# EAGLE design untitled (EAGLE 8.4.3)
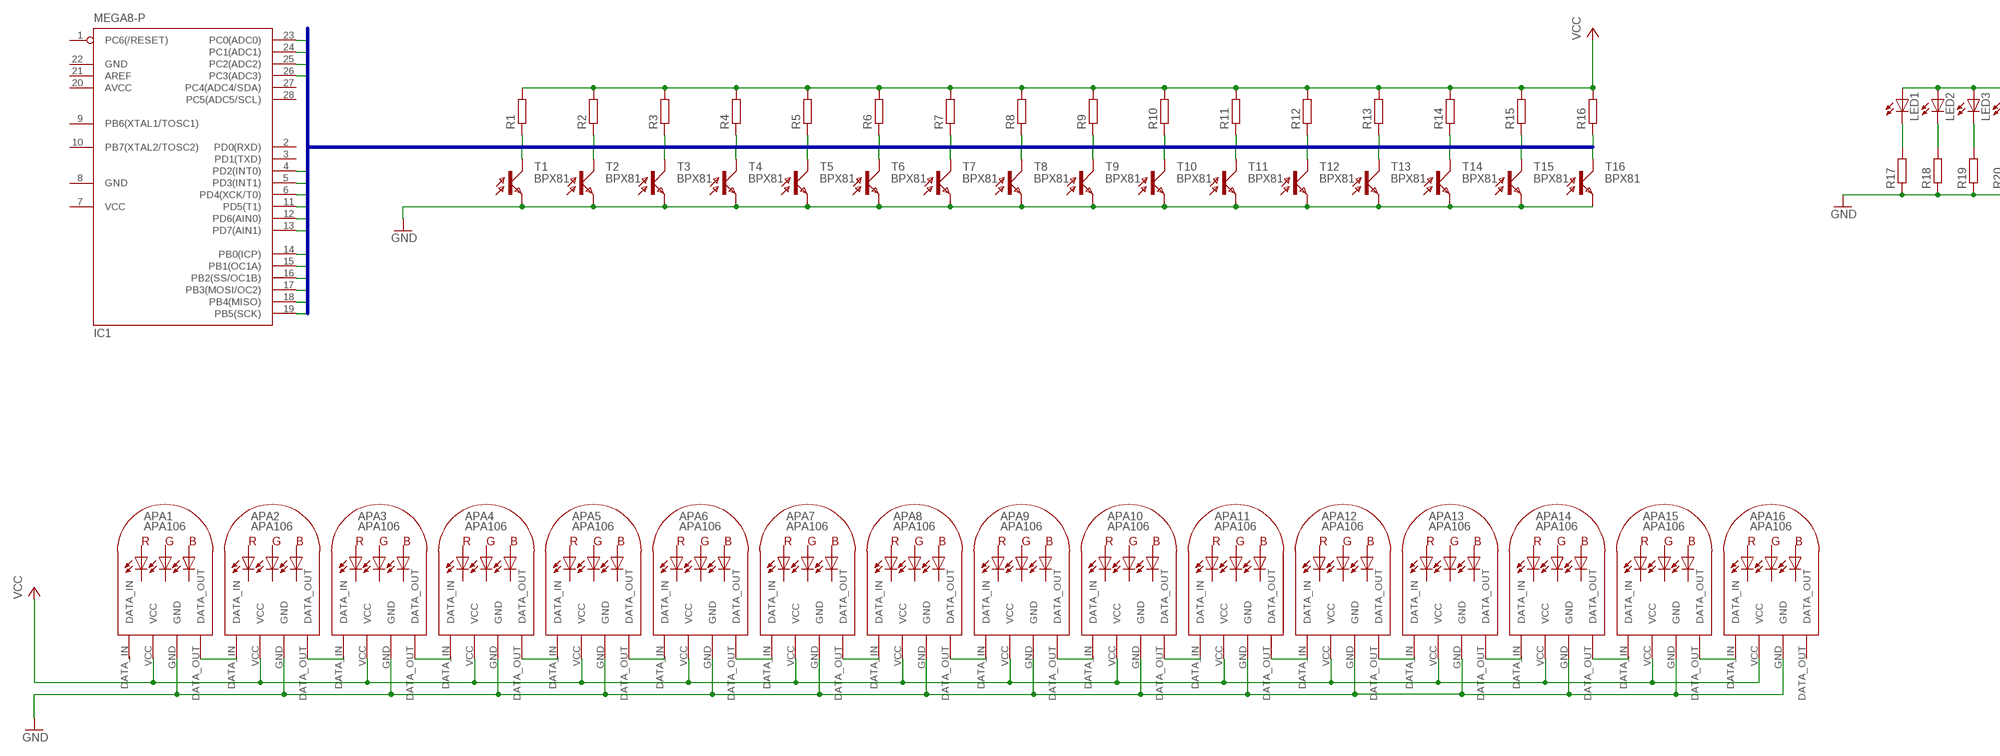
[diagram p0: schematic, sheet 1, part 1 of 2]
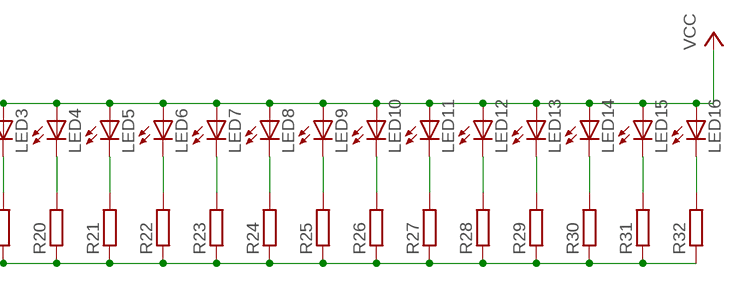
[diagram p1: schematic, sheet 1, part 2 of 2]

## Parts
APA1  APA106  [APA_106_8MM]
APA2  APA106  [APA_106_8MM]
APA3  APA106  [APA_106_8MM]
APA4  APA106  [APA_106_8MM]
APA5  APA106  [APA_106_8MM]
APA6  APA106  [APA_106_8MM]
APA7  APA106  [APA_106_8MM]
APA8  APA106  [APA_106_8MM]
APA9  APA106  [APA_106_8MM]
APA10  APA106  [APA_106_8MM]
APA11  APA106  [APA_106_8MM]
APA12  APA106  [APA_106_8MM]
APA13  APA106  [APA_106_8MM]
APA14  APA106  [APA_106_8MM]
APA15  APA106  [APA_106_8MM]
APA16  APA106  [APA_106_8MM]
IC1  MEGA8-P  [DIL28-3]
LED1  LEDLZR181  [LZR181]
LED2  LEDLZR181  [LZR181]
LED3  LEDLZR181  [LZR181]
LED4  LEDLZR181  [LZR181]
LED5  LEDLZR181  [LZR181]
LED6  LEDLZR181  [LZR181]
LED7  LEDLZR181  [LZR181]
LED8  LEDLZR181  [LZR181]
LED9  LEDLZR181  [LZR181]
LED10  LEDLZR181  [LZR181]
LED11  LEDLZR181  [LZR181]
LED12  LEDLZR181  [LZR181]
LED13  LEDLZR181  [LZR181]
LED14  LEDLZR181  [LZR181]
LED15  LEDLZR181  [LZR181]
LED16  LEDLZR181  [LZR181]
R1  R-EU_R0603  [R0603]
R2  R-EU_R0603  [R0603]
R3  R-EU_R0603  [R0603]
R4  R-EU_R0603  [R0603]
R5  R-EU_R0603  [R0603]
R6  R-EU_R0603  [R0603]
R7  R-EU_R0603  [R0603]
R8  R-EU_R0603  [R0603]
R9  R-EU_R0603  [R0603]
R10  R-EU_R0603  [R0603]
R11  R-EU_R0603  [R0603]
R12  R-EU_R0603  [R0603]
R13  R-EU_R0603  [R0603]
R14  R-EU_R0603  [R0603]
R15  R-EU_R0603  [R0603]
R16  R-EU_R0603  [R0603]
R17  R-EU_R0603  [R0603]
R18  R-EU_R0603  [R0603]
R19  R-EU_R0603  [R0603]
R20  R-EU_R0603  [R0603]
R21  R-EU_R0603  [R0603]
R22  R-EU_R0603  [R0603]
R23  R-EU_R0603  [R0603]
R24  R-EU_R0603  [R0603]
R25  R-EU_R0603  [R0603]
R26  R-EU_R0603  [R0603]
R27  R-EU_R0603  [R0603]
R28  R-EU_R0603  [R0603]
R29  R-EU_R0603  [R0603]
R30  R-EU_R0603  [R0603]
R31  R-EU_R0603  [R0603]
R32  R-EU_R0603  [R0603]
T1  BPX81  [BPX81]
T2  BPX81  [BPX81]
T3  BPX81  [BPX81]
T4  BPX81  [BPX81]
T5  BPX81  [BPX81]
T6  BPX81  [BPX81]
T7  BPX81  [BPX81]
T8  BPX81  [BPX81]
T9  BPX81  [BPX81]
T10  BPX81  [BPX81]
T11  BPX81  [BPX81]
T12  BPX81  [BPX81]
T13  BPX81  [BPX81]
T14  BPX81  [BPX81]
T15  BPX81  [BPX81]
T16  BPX81  [BPX81]

## Nets
GND: APA1.GND APA2.GND APA3.GND APA4.GND APA5.GND APA6.GND APA7.GND APA8.GND APA9.GND APA10.GND APA11.GND APA12.GND APA13.GND APA14.GND APA15.GND APA16.GND R17.1 R18.1 R19.1 R20.1 R21.1 R22.1 R23.1 R24.1 R25.1 R26.1 R27.1 R28.1 R29.1 R30.1 R31.1 R32.1 T1.E T2.E T3.E T4.E T5.E T6.E T7.E T8.E T9.E T10.E T11.E T12.E T13.E T14.E T15.E T16.E
N$1: APA1.DATA_OUT APA2.DATA_IN
N$2: APA2.DATA_OUT APA3.DATA_IN
N$3: APA3.DATA_OUT APA4.DATA_IN
N$4: APA4.DATA_OUT APA5.DATA_IN
N$5: APA5.DATA_OUT APA6.DATA_IN
N$6: APA6.DATA_OUT APA7.DATA_IN
N$7: APA7.DATA_OUT APA8.DATA_IN
N$8: APA8.DATA_OUT APA9.DATA_IN
N$9: APA9.DATA_OUT APA10.DATA_IN
N$10: APA10.DATA_OUT APA11.DATA_IN
N$11: APA11.DATA_OUT APA12.DATA_IN
N$12: APA12.DATA_OUT APA13.DATA_IN
N$13: APA13.DATA_OUT APA14.DATA_IN
N$14: APA14.DATA_OUT APA15.DATA_IN
N$15: APA15.DATA_OUT APA16.DATA_IN
N$16: LED1.K(C) R17.2
N$17: LED2.K(C) R18.2
N$18: LED3.K(C) R19.2
N$19: LED4.K(C) R20.2
N$20: LED5.K(C) R21.2
N$21: LED6.K(C) R22.2
N$22: LED7.K(C) R23.2
N$23: LED8.K(C) R24.2
N$24: LED9.K(C) R25.2
N$25: LED10.K(C) R26.2
N$26: LED11.K(C) R27.2
N$27: LED12.K(C) R28.2
N$28: LED13.K(C) R29.2
N$29: LED14.K(C) R30.2
N$30: LED15.K(C) R31.2
N$31: LED16.K(C) R32.2
PT1: IC1.23(PC0(ADC0)) R1.1 T1.C
PT2: IC1.24(PC1(ADC1)) R2.1 T2.C
PT3: IC1.25(PC2(ADC2)) R3.1 T3.C
PT4: IC1.26(PC3(ADC3)) R4.1 T4.C
PT5: IC1.18(PB4(MISO)) R5.1 T5.C
PT6: IC1.19(PB5(SCK)) R6.1 T6.C
PT7: IC1.4(PD2(INT0)) R7.1 T7.C
PT8: IC1.5(PD3(INT1)) R8.1 T8.C
PT9: IC1.6(PD4(XCK/T0)) R9.1 T9.C
PT10: IC1.11(PD5(T1)) R10.1 T10.C
PT11: IC1.12(PD6(AIN0)) R11.1 T11.C
PT12: IC1.13(PD7(AIN1)) R12.1 T12.C
PT13: IC1.14(PB0(ICP)) R13.1 T13.C
PT14: IC1.15(PB1(OC1A)) R14.1 T14.C
PT15: IC1.16(PB2(SS/OC1B)) R15.1 T15.C
PT16: IC1.17(PB3(MOSI/OC2)) R16.1 T16.C
VCC: APA1.VCC APA2.VCC APA3.VCC APA4.VCC APA5.VCC APA6.VCC APA7.VCC APA8.VCC APA9.VCC APA10.VCC APA11.VCC APA12.VCC APA13.VCC APA14.VCC APA15.VCC APA16.VCC LED1.A LED2.A LED3.A LED4.A LED5.A LED6.A LED7.A LED8.A LED9.A LED10.A LED11.A LED12.A LED13.A LED14.A LED15.A LED16.A R1.2 R2.2 R3.2 R4.2 R5.2 R6.2 R7.2 R8.2 R9.2 R10.2 R11.2 R12.2 R13.2 R14.2 R15.2 R16.2
Unconnected: APA1.DATA_IN APA16.DATA_OUT IC1.1(PC6(/RESET)) IC1.2(PD0(RXD)) IC1.3(PD1(TXD)) IC1.9(PB6(XTAL1/TOSC1)) IC1.10(PB7(XTAL2/TOSC2)) IC1.21(AREF) IC1.27(PC4(ADC4/SDA)) IC1.28(PC5(ADC5/SCL))

## Buses
PT[1..16]

## Power pins joined to a net without a drawn wire
AVCC: IC1.20(AVCC)
GND: IC1.8(GND) IC1.22(GND)
VCC: IC1.7(VCC)

## Library data of the parts
APA1-APA16 = apa106:APA106
IC1 = atmel:MEGA8-P: MICROCONTROLLER 8 Kbytes FLASH, 1 kbytes SRAM, 512 bytes EEPROM, USART, 4-channel 10 bit ADC, 2-channel 8 bit ADC Pin compatible with Atmega48, ATMega88, ATMega168 Source: avr.lbr; OC_FARNELL: unknown; OC_NEWARK: unknown
LED1-LED16 = adafruit:LED: LED OSRAM: - CHIPLED LG R971, LG N971, LY N971, LG Q971, LY Q971, LO R971, LY R971 LH N974, LH R974 LS Q976, LO Q976, LY Q976 LO Q996 - Hyper CHIPLED LW Q18S LB Q993, LB Q99A, LB R99A - SideLED LS A670, LO A670, LY A670, LG A670, LP A670 LB A673, LV A673, LT A673, LW A673 LH A674 LY A675 LS A676, LA A676, LO A676, LY A676, LW A676 LS A679, LY A679, LG A679 - Hyper Micro SIDELED® LS Y876, LA Y876, LO Y876, LY Y876 LT Y87S - SmartLED LW L88C, LW L88S LB L89C, LB L89S, LG L890 LS L89K, LO L89K, LY L89K LS L896, LA L896, LO L896, LY L896 - TOPLED LS T670, LO T670, LY T670, LG T670, LP T670 LSG T670, LSP T670, LSY T670, LOP T670, LYG T670 LG T671, LOG T671, LSG T671 LB T673, LV T673, LT T673, LW T673 LH T674 LS T676, LA T676, LO T676, LY T676, LB T676, LH T676, LSB T676, LW T676 LB T67C, LV T67C, LT T67C, LS T67K, LO T67K, LY T67K, LW E67C LS E67B, LA E67B, LO E67B, LY E67B, LB E67C, LV E67C, LT E67C LW T67C LS T679, LY T679, LG T679 LS T770, LO T770, LY T770, LG T770, LP T770 LB T773, LV T773, LT T773, LW T773 LH T774 LS E675, LA E675, LY E675, LS T675 LS T776, LA T776, LO T776, LY T776, LB T776 LHGB T686 LT T68C, LB T68C - Hyper Mini TOPLED® LB M676 - Mini TOPLED Santana® LG M470 LS M47K, LO M47K, LY M47K Source: http://www.osram.convergy.de/
R1-R32 = rcl:R-EU_: RESISTOR, European symbol
T1-T16 = opto-trans-siemens:BPX81: PHOTO TRANSISTOR; OC_FARNELL: unknown; OC_NEWARK: unknown

## Board
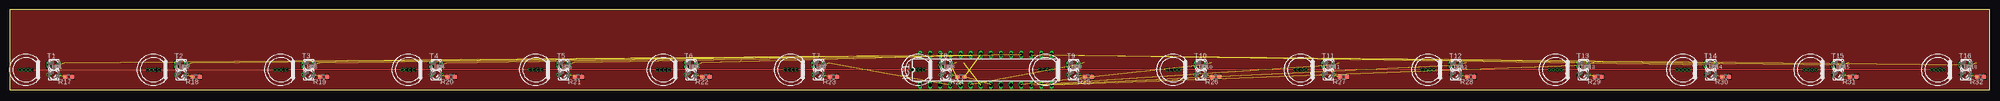
[diagram p2: board, top side]
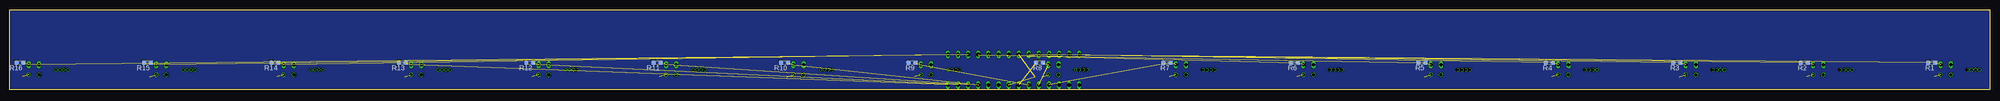
[diagram p3: board, bottom side, seen from below]

Size 497 x 20 mm. Coordinates in mm from the lower left corner, seen from the top.
Outline: 0,20 0,0 497,0 497,20 0,20
Copper layers (1*16): Top 0.035mm / dielectric 1.5mm / Bottom 0.035mm
Design rules "homelight *": minimum track width 0.1mm, minimum drill 0.2mm, track to track 0.15mm, track to pad 0.1mm, pad to pad 0.1mm, via to via 0.1mm, smd to smd 0mil, copper to edge 0.2mm, drill to drill 0.21mm, minimum pad ring 0.05mm, minimum via ring 0.05mm, stop-mask expansion 0.01mm, vias tented up to drill 32mil, thermal gap 10mil

### Footprints (pad centres in the part's own frame; a part is rotated, then mirrored left to right if it is on the bottom)
APA_106_8MM = drill 0.6 pad 0.813: DATA_IN -1.5,0; DATA_OUT 1.5,0; GND 0.5,0; VCC -0.5,0
DIL28-3 = drill 0.813 long: 1 -16.51,-3.81; 2 -13.97,-3.81; 3 -11.43,-3.81; 4 -8.89,-3.81; 5 -6.35,-3.81; 6 -3.81,-3.81; 7 -1.27,-3.81; 8 1.27,-3.81; 9 3.81,-3.81; 10 6.35,-3.81; 11 8.89,-3.81; 12 11.43,-3.81; 13 13.97,-3.81; 14 16.51,-3.81; 15 16.51,3.81; 16 13.97,3.81; 17 11.43,3.81; 18 8.89,3.81; 19 6.35,3.81; 20 3.81,3.81; 21 1.27,3.81; 22 -1.27,3.81; 23 -3.81,3.81; 24 -6.35,3.81; 25 -8.89,3.81; 26 -11.43,3.81; 27 -13.97,3.81; 28 -16.51,3.81
LZR181 = drill 0.813 octagon: A -1.27,0; K 1.27,0
R0603 = smd 1 x 1.1: 1 -0.85,0; 2 0.85,0
BPX81 = drill 0.813 long: C 1.27,0; E -1.27,0

### Placement (x,y rotation side)
APA1  4,5 0 top
APA2  36,5 0 top
APA3  68,5 0 top
APA4  100,5 0 top
APA5  132,5 0 top
APA6  164,5 0 top
APA7  196,5 0 top
APA8  228,5 0 top
APA9  260,5 0 top
APA10  292,5 0 top
APA11  324,5 0 top
APA12  356,5 0 top
APA13  388,5 0 top
APA14  420,5 0 top
APA15  452,5 0 top
APA16  484,5 0 top
IC1  245,5 0 top
LED1  11,3.75 0 top
LED2  43,3.75 0 top
LED3  75,3.75 0 top
LED4  107,3.75 0 top
LED5  139,3.75 0 top
LED6  171,3.75 0 top
LED7  203,3.75 0 top
LED8  235,3.75 0 top
LED9  267,3.75 0 top
LED10  299,3.75 0 top
LED11  331,3.75 0 top
LED12  363,3.75 0 top
LED13  395,3.75 0 top
LED14  427,3.75 0 top
LED15  459,3.75 0 top
LED16  491,3.75 0 top
R1  14.5,6.75 180 bottom
R2  46.5,6.75 180 bottom
R3  78.5,6.75 180 bottom
R4  110.5,6.75 180 bottom
R5  142.5,6.75 180 bottom
R6  174.5,6.75 180 bottom
R7  206.5,6.75 180 bottom
R8  238.5,6.75 180 bottom
R9  270.5,6.75 180 bottom
R10  302.5,6.75 180 bottom
R11  334.5,6.75 180 bottom
R12  366.5,6.75 180 bottom
R13  398.5,6.75 180 bottom
R14  430.5,6.75 180 bottom
R15  462.5,6.75 180 bottom
R16  494.5,6.75 180 bottom
R17  14.75,3.25 180 top
R18  46.75,3.25 180 top
R19  78.75,3.25 180 top
R20  110.75,3.25 180 top
R21  142.75,3.25 180 top
R22  174.75,3.25 180 top
R23  206.75,3.25 180 top
R24  238.75,3.25 180 top
R25  270.75,3.25 180 top
R26  302.75,3.25 180 top
R27  334.75,3.25 180 top
R28  366.75,3.25 180 top
R29  398.75,3.25 180 top
R30  430.75,3.25 180 top
R31  462.75,3.25 180 top
R32  494.75,3.25 180 top
T1  11,6.25 0 top
T2  43,6.25 0 top
T3  75,6.25 0 top
T4  107,6.25 0 top
T5  139,6.25 0 top
T6  171,6.25 0 top
T7  203,6.25 0 top
T8  235,6.25 0 top
T9  267,6.25 0 top
T10  299,6.25 0 top
T11  331,6.25 0 top
T12  363,6.25 0 top
T13  395,6.25 0 top
T14  427,6.25 0 top
T15  459,6.25 0 top
T16  491,6.25 0 top

### Tracks (layer width: path | path; a pad name or v marks a point on that pad's centre or on a via)
GND  (2 unrouted)
  pour Top: 0,20 0,0 497,0 497,20
N$1
  Top 0.102: APA1.DATA_OUT APA2.DATA_IN
N$2
  Top 0.102: APA2.DATA_OUT APA3.DATA_IN
N$3
  Top 0.152: APA4.DATA_IN APA3.DATA_OUT
N$4
  Top 0.152: APA5.DATA_IN APA4.DATA_OUT
N$5
  Top 0.152: APA6.DATA_IN APA5.DATA_OUT
N$6
  Top 0.152: APA7.DATA_IN APA6.DATA_OUT
N$7
  Top 0.152: APA8.DATA_IN APA7.DATA_OUT
N$8
  Top 0.152: APA9.DATA_IN APA8.DATA_OUT
N$9
  Top 0.152: APA10.DATA_IN APA9.DATA_OUT
N$10
  Top 0.152: APA11.DATA_IN APA10.DATA_OUT
N$11
  Top 0.152: APA12.DATA_IN APA11.DATA_OUT
N$12
  Top 0.152: APA13.DATA_IN APA12.DATA_OUT
N$13
  Top 0.152: APA14.DATA_IN APA13.DATA_OUT
N$14
  Top 0.152: APA15.DATA_IN APA14.DATA_OUT
N$15
  Top 0.152: APA16.DATA_IN APA15.DATA_OUT
N$16  (1 unrouted)
N$17  (1 unrouted)
N$18  (1 unrouted)
N$19  (1 unrouted)
N$20  (1 unrouted)
N$21  (1 unrouted)
N$22  (1 unrouted)
N$23  (1 unrouted)
N$24  (1 unrouted)
N$25  (1 unrouted)
N$26  (1 unrouted)
N$27  (1 unrouted)
N$28  (1 unrouted)
N$29  (1 unrouted)
N$30  (1 unrouted)
N$31  (1 unrouted)
PT1  (2 unrouted)
PT2  (2 unrouted)
PT3  (2 unrouted)
PT4  (2 unrouted)
PT5  (2 unrouted)
PT6  (2 unrouted)
PT7  (2 unrouted)
PT8  (2 unrouted)
PT9  (2 unrouted)
PT10  (2 unrouted)
PT11  (2 unrouted)
PT12  (2 unrouted)
PT13  (2 unrouted)
PT14  (2 unrouted)
PT15  (2 unrouted)
PT16  (2 unrouted)
VCC  (1 unrouted)
  pour Bottom: 0,20 0,0 497,0 497,20